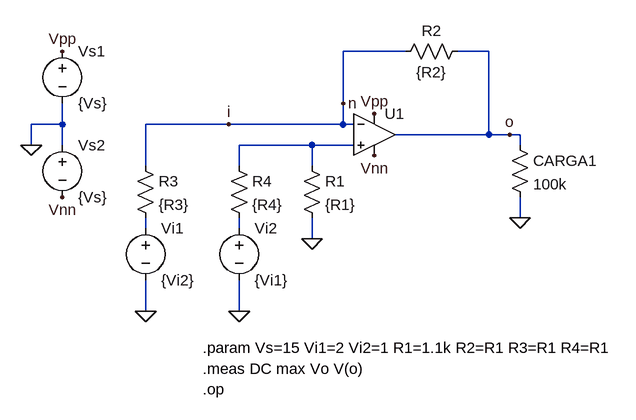
[diagram p0: schematic ex1e.asc]
ex1e.asc, the LTspice schematic file:
Version 4
SHEET 1 880 680
WIRE 272 -32 176 -32
WIRE 400 -32 352 -32
WIRE 176 48 176 -32
WIRE -256 80 -256 48
WIRE -256 80 -304 80
WIRE 0 80 -128 80
WIRE 176 80 176 48
WIRE 176 80 0 80
WIRE 192 80 176 80
WIRE 400 96 400 -32
WIRE 400 96 256 96
WIRE 432 96 400 96
WIRE 448 96 432 96
WIRE -304 112 -304 80
WIRE -256 112 -256 80
WIRE 128 112 16 112
WIRE 192 112 128 112
WIRE 448 112 448 96
WIRE -128 144 -128 80
WIRE 16 144 16 112
WIRE 128 144 128 112
WIRE 448 224 448 192
WIRE -128 240 -128 224
WIRE 16 240 16 224
WIRE 128 256 128 224
WIRE -128 368 -128 320
WIRE 16 368 16 320
FLAG -128 368 0
FLAG 448 224 0
FLAG -304 112 0
FLAG -256 -32 Vpp
FLAG -256 192 Vnn
FLAG 432 96 o
FLAG 0 80 i
FLAG 224 64 Vpp
FLAG 224 128 Vnn
FLAG 176 48 n
FLAG 16 368 0
FLAG 128 256 0
SYMBOL voltage -128 224 R0
SYMATTR InstName Vi1
SYMATTR Value {Vi2}
SYMBOL res 368 -48 R90
WINDOW 0 0 56 VBottom 2
WINDOW 3 32 56 VTop 2
SYMATTR InstName R2
SYMATTR Value {R2}
SYMBOL OpAmps\\UniversalOpAmp2 224 96 R0
SYMATTR InstName U1
SYMATTR Value2 Avol=125 GBW=10Meg Slew=10Meg
SYMBOL voltage -256 -48 R0
SYMATTR InstName Vs1
SYMATTR Value {Vs}
SYMBOL voltage -256 96 R0
SYMATTR InstName Vs2
SYMATTR Value {Vs}
SYMBOL res 432 96 R0
SYMATTR InstName CARGA1
SYMATTR Value 100k
SYMBOL res -144 128 R0
SYMATTR InstName R3
SYMATTR Value {R3}
SYMBOL voltage 16 224 R0
SYMATTR InstName Vi2
SYMATTR Value {Vi1}
SYMBOL res 0 128 R0
SYMATTR InstName R4
SYMATTR Value {R4}
SYMBOL res 112 128 R0
SYMATTR InstName R1
SYMATTR Value {R1}
TEXT -40 424 Left 2 !.param Vs=15 Vi1=2 Vi2=1 R1=1.1k R2=R1 R3=R1 R4=R1
TEXT -40 488 Left 2 !.op
TEXT -40 456 Left 2 !.meas DC max Vo V(o)

The netlist it stands for:
* ex1e.asc
Vi1 N002 0 {Vi2}
R2 o n {R2}
XU1 N001 n Vpp Vnn o level2 Avol=125 GBW=10Meg Slew=10Meg Ilimit=25m Rail=0 Vos=0 En=0 Enk=0 In=0 Ink=0 Rin=500Meg  ; pins In+ In- V+ V- OUT
Vs1 Vpp 0 {Vs}
Vs2 0 Vnn {Vs}
R§CARGA1 o 0 100k
R3 n N002 {R3}
Vi2 N003 0 {Vi1}
R4 N001 N003 {R4}
R1 N001 0 {R1}
.param Vs=15 Vi1=2 Vi2=1 R1=1.1k R2=R1 R3=R1 R4=R1
.op
.meas DC max Vo V(o)
.lib UniversalOpAmp2.lib
.backanno
.end